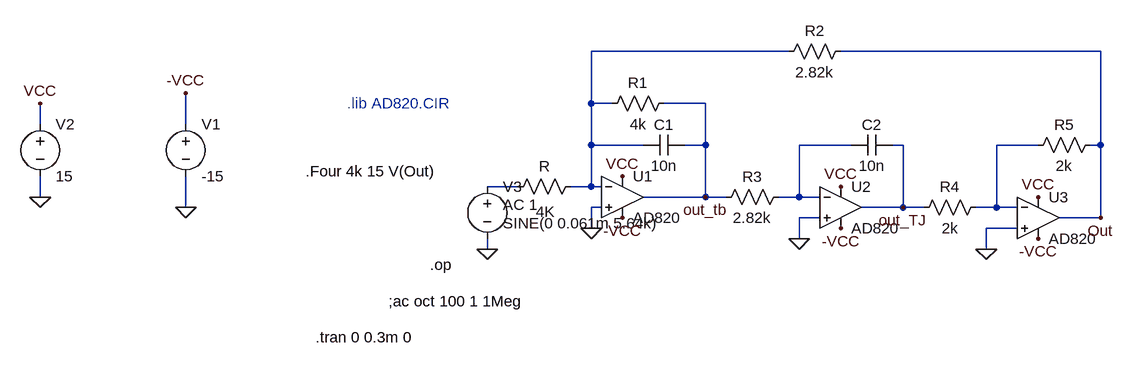
[diagram p0: schematic Filtru analogic.asc]
Filtru analogic.asc, the LTspice schematic file:
Version 4
SHEET 1 880 680
WIRE -1552 -496 -1856 -496
WIRE -1072 -496 -1472 -496
WIRE -1856 -416 -1856 -496
WIRE -1824 -416 -1856 -416
WIRE -1680 -416 -1744 -416
WIRE -2704 -384 -2704 -416
WIRE -2480 -384 -2480 -432
WIRE -1856 -352 -1856 -416
WIRE -1776 -352 -1856 -352
WIRE -1680 -352 -1680 -416
WIRE -1680 -352 -1712 -352
WIRE -1456 -352 -1536 -352
WIRE -1376 -352 -1392 -352
WIRE -1168 -352 -1232 -352
WIRE -1072 -352 -1072 -496
WIRE -1072 -352 -1088 -352
WIRE -1968 -288 -2016 -288
WIRE -1856 -288 -1856 -352
WIRE -1856 -288 -1888 -288
WIRE -1840 -288 -1856 -288
WIRE -2704 -272 -2704 -304
WIRE -1680 -272 -1680 -352
WIRE -1680 -272 -1776 -272
WIRE -1648 -272 -1680 -272
WIRE -1536 -272 -1536 -352
WIRE -1536 -272 -1568 -272
WIRE -1504 -272 -1536 -272
WIRE -2480 -256 -2480 -304
WIRE -1840 -256 -1856 -256
WIRE -1376 -256 -1376 -352
WIRE -1376 -256 -1440 -256
WIRE -1344 -256 -1376 -256
WIRE -1232 -256 -1232 -352
WIRE -1232 -256 -1264 -256
WIRE -1200 -256 -1232 -256
WIRE -1504 -240 -1536 -240
WIRE -1072 -240 -1072 -352
WIRE -1072 -240 -1136 -240
WIRE -1856 -224 -1856 -256
WIRE -1200 -224 -1248 -224
WIRE -1536 -208 -1536 -240
WIRE -2016 -192 -2016 -208
WIRE -1248 -192 -1248 -224
FLAG -1856 -224 0
FLAG -1536 -208 0
FLAG -1248 -192 0
FLAG -1808 -304 VCC
FLAG -1472 -288 VCC
FLAG -1168 -272 VCC
FLAG -1808 -240 -VCC
FLAG -1472 -224 -VCC
FLAG -1168 -208 -VCC
FLAG -2704 -416 VCC
FLAG -2480 -432 -VCC
FLAG -2480 -256 0
FLAG -2704 -272 0
FLAG -2016 -192 0
FLAG -1680 -272 out_tb
FLAG -1376 -256 out_TJ
FLAG -1072 -240 Out
DATAFLAG -1872 -288 ""
DATAFLAG -1072 -240 ""
DATAFLAG -1088 -496 ""
DATAFLAG -1728 -496 ""
DATAFLAG -1664 -272 ""
DATAFLAG -1344 -256 ""
DATAFLAG -1072 -240 ""
DATAFLAG -1088 -240 ""
SYMBOL res -1728 -432 R90
WINDOW 0 0 56 VBottom 2
WINDOW 3 32 56 VTop 2
SYMATTR InstName R1
SYMATTR Value 4k
SYMBOL cap -1712 -368 R90
WINDOW 0 0 32 VBottom 2
WINDOW 3 32 32 VTop 2
SYMATTR InstName C1
SYMATTR Value 10n
SYMBOL OpAmps\\AD820 -1808 -336 R0
SYMATTR InstName U1
SYMBOL res -1456 -512 R90
WINDOW 0 0 56 VBottom 2
WINDOW 3 32 56 VTop 2
SYMATTR InstName R2
SYMATTR Value 2.82k
SYMBOL res -1552 -288 R90
WINDOW 0 0 56 VBottom 2
WINDOW 3 32 56 VTop 2
SYMATTR InstName R3
SYMATTR Value 2.82k
SYMBOL cap -1392 -368 R90
WINDOW 0 0 32 VBottom 2
WINDOW 3 32 32 VTop 2
SYMATTR InstName C2
SYMATTR Value 10n
SYMBOL OpAmps\\AD820 -1472 -320 R0
SYMATTR InstName U2
SYMBOL res -1248 -272 R90
WINDOW 0 0 56 VBottom 2
WINDOW 3 32 56 VTop 2
SYMATTR InstName R4
SYMATTR Value 2k
SYMBOL OpAmps\\AD820 -1168 -304 R0
SYMATTR InstName U3
SYMBOL res -1872 -304 R90
WINDOW 0 0 56 VBottom 2
WINDOW 3 39 54 VTop 2
SYMATTR InstName R
SYMATTR Value 4K
SYMBOL voltage -2480 -400 R0
WINDOW 123 0 0 Left 0
WINDOW 39 0 0 Left 0
SYMATTR InstName V1
SYMATTR Value -15
SYMBOL voltage -2704 -400 R0
WINDOW 123 0 0 Left 0
WINDOW 39 0 0 Left 0
SYMATTR InstName V2
SYMATTR Value 15
SYMBOL voltage -2016 -304 R0
WINDOW 123 24 44 Left 2
WINDOW 39 0 0 Left 0
WINDOW 3 24 72 Left 2
SYMATTR Value2 AC 1
SYMATTR Value SINE(0 0.061m 5.64k)
SYMATTR InstName V3
SYMBOL res -1072 -368 R90
WINDOW 0 0 56 VBottom 2
WINDOW 3 32 56 VTop 2
SYMATTR InstName R5
SYMATTR Value 2k
TEXT -2280 -56 Left 2 !.tran 0 0.3m 0
TEXT -2104 -168 Left 2 !.op
TEXT -2168 -112 Left 2 !;ac oct 100 1 1Meg
TEXT -2232 -416 Left 2 ;.lib AD820.CIR
TEXT -2296 -312 Left 2 !.Four 4k 15 V(Out)

The netlist it stands for:
* Filtru analogic.asc
R1 out_tb N001 4k
C1 out_tb N001 10n
XU1 0 N001 VCC -VCC out_tb AD820  ; pins In+ In- V+ V- OUT
R2 Out N001 2.82k
R3 N002 out_tb 2.82k
C2 out_TJ N002 10n
XU2 0 N002 VCC -VCC out_TJ AD820  ; pins In+ In- V+ V- OUT
R4 N003 out_TJ 2k
XU3 0 N003 VCC -VCC Out AD820  ; pins In+ In- V+ V- OUT
R N001 N004 4K
V1 -VCC 0 -15
V2 VCC 0 15
V3 N004 0 SINE(0 0.061m 5.64k) AC 1
R5 Out N003 2k
.tran 0 0.3m 0
.op
;ac oct 100 1 1Meg
* .lib AD820.CIR
.Four 4k 15 V(Out)
.backanno
.end